# Altium schematic sheet Power.SchDoc
size A3; SheetNumber: 9; SheetTotal: 11
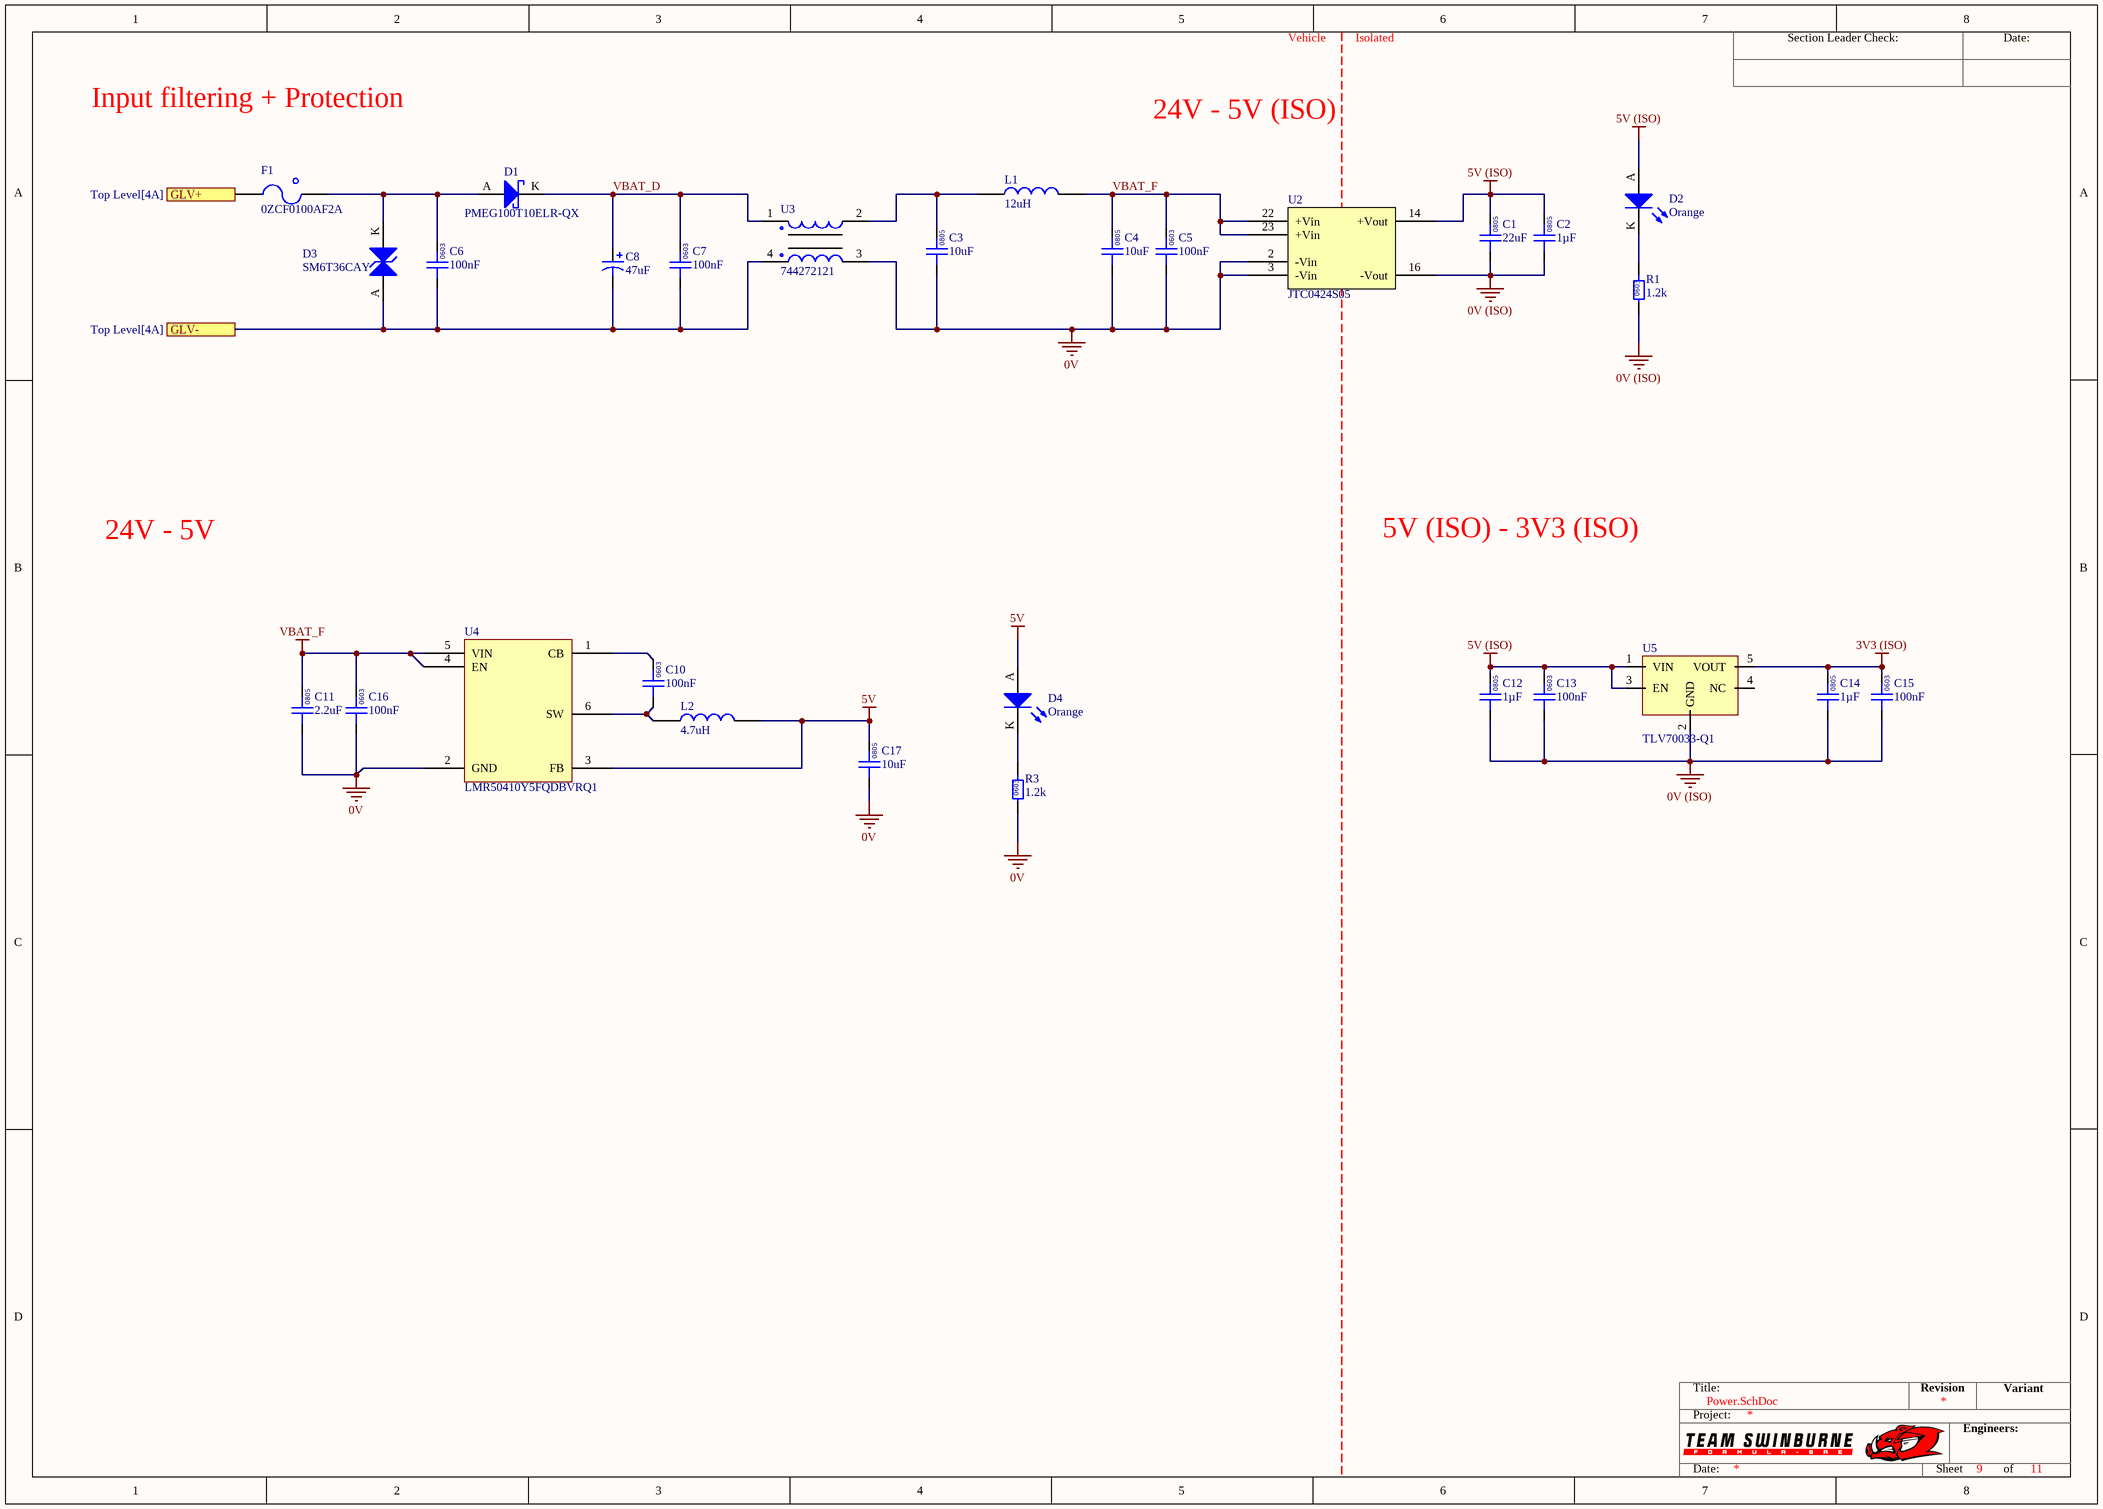
[diagram p0: Power.SchDoc]

## Parts
C1  22uF  [0805]
C2  1µF  [0805]
C3  10uF  [0805]
C4  10uF  [0805]
C5  100nF  [0603]
C6  100nF  [0603]
C7  100nF  [0603]
C8  47uF  [CHEMI-CON ELCO]
C10  100nF  [0603]
C11  2.2uF  [0805]
C12  1µF  [0805]
C13  100nF  [0603]
C14  1µF  [0805]
C15  100nF  [0603]
C16  100nF  [0603]
C17  10uF  [0805]
D1  PMEG100T10ELR-QX  [NXP SOD123W]
D2  Orange  [0805 LED]
D3  SM6T36CAY  [ST SMB DIODE]
D4  Orange  [0805 LED]
F1  0ZCF0100AF2A  [2920]
L1  12uH  [1812]
L2  4.7uH  [SRN3015TA-4R7M]
R1  1.2k  [0603]
R3  1.2k  [0603]
U2  JTC0424S05  [24-DIP Module, 7 Leads]
U3  744272121  [Wurth 4-PC Pad]
U4  LMR50410Y5FQDBVRQ1  [TI-SOT23-6]
U5  TLV70033-Q1  [TI SOT-23-5]

## Ports
GLV+ (see Top Level[4A]), GLV- (see Top Level[4A])

## Nets
0V: C3.1 C4.1 C5.1 C11.1 C16.1 C17.1 R3.1 U2.2(-Vin) U2.3(-Vin) U3.3 U4.2(GND)
0V (ISO): C1.1 C2.1 C12.1 C13.1 C14.1 C15.1 R1.1 U2.16(-Vout) U5.2(GND)
3V3 (ISO): C14.2 C15.2 U5.5(VOUT)
5V: C17.2 D4.A L2.1 U4.3(FB)
5V (ISO): C1.2 C2.2 C12.2 C13.2 D2.A U2.14(+Vout) U5.1(VIN) U5.3(EN)
VBAT_F: C4.2 C5.2 C11.2 C16.2 L1.1 U2.22(+Vin) U2.23(+Vin) U4.4(EN) U4.5(VIN)
GLV+: F1.1 ; port GLV+
GLV-: C6.1 C7.1 C8.1 D3.A U3.4 ; port GLV-
VBAT_D: C7.2 C8.2 D1.K U3.1
NetC3_2: C3.2 L1.2 U3.2
NetC6_2: C6.2 D1.A D3.K F1.2
NetC10_1: C10.1 L2.2 U4.6(SW)
NetC10_2: C10.2 U4.1(CB)
NetD2_K: D2.K R1.2
NetD4_K: D4.K R3.2

Not connected (* = marked no-connect by the designer): U5 4(NC)

## Notes on the sheet
- Vehicle
- Isolated
- Input filtering + Protection
- 24V - 5V (ISO)
- 24V - 5V
- 5V (ISO) - 3V3 (ISO)
- Section Leader Check:
- Date:
- Title:
- Revision
- Variant
- Project:
- Engineers:
- Sheet
- of
- (in symbol GCM21BR71H105KA03L) 0805
- (in symbol GCM188L81H104KA57D) 0603
- (in symbol GRM21BR6YA106KE43L) 0805
- (in symbol GRM21BR61A226ME51L) 0805
- (in symbol GRM21BR71E225KE11L) 0805
- (in symbol RC0603JR-071K2L) 0603

## Library data of the parts
C1 = GRM21BR61A226ME51L: Manufacturer: muRata; Rated Voltage: 10V; Tolerance: 20%; Material: MLCC; Temperature Rating: X5R; Part Number: GRM21BR61A226ME51L; Value: 22uF; Digikey Part Number: 490-10511-1-ND
C2 C12 C14 = GCM21BR71H105KA03L: Manufacturer: muRata; Rated Voltage: 50V; Tolerance: ±10%; Material: MLCC; Temperature Rating: X7R; Part Number: GCM21BR71H105KA03L; Value: 1µF; Digikey Part Number: 490-10675-1-ND
C3 C4 C17 = GRM21BR6YA106KE43L: Manufacturer: muRata; Rated Voltage: 50V; Tolerance: 10%; Material: MLCC; Temperature Rating: X5R; Part Number: GRM21BR6YA106KE43L; Value: 10uF; Digikey Part Number: 490-10514-6-ND
C5-C7 C10 C13 C15 C16 = GCM188L81H104KA57D: Manufacturer: muRata; Rated Voltage: 50V; Tolerance: ±10%; Material: MLCC; Temperature Rating: X8L; Part Number: GCM188L81H104KA57D; Value: 100nF; Digikey Part Number: 490-6049-1-ND
C8 = HHXA350ARA470MF61G: Manufacturer: Chemi-Con; Rated Voltage: 35V; Tolerance: 20%; Material: Aluminium Electrolytic; Temperature Rating: 125C; Part Number: HHXA350ARA470MF61G; Value: 47uF
C11 = GRM21BR71E225KE11L: Manufacturer: Murata Electronics; Rated Voltage: 25V; Tolerance: ±10%; Material: MLCC; Temperature Rating: X7R; Part Number: GRM21BR71E225KE11L; Value: 2.2uF; Digikey Part Number: 490-14467-2-ND
D1 = PMEG100T10ELR-QX: Manufacturer: Nexperia USA Inc.; Forward Voltage: 0.75 V @ 1A; Breakdown Voltage: 100 V; Rated Power: 680 mW; Part Number: PMEG100T10ELR-QX; Digikey Part Number: 1727-PMEG100T10ELR-QXCT-ND
D2 D4 = SML-211DTT86: Orange LED Indication - Discrete 1.75V 0805 (2012 Metric); Manufacturer: ROHM Semiconductor; Part Number: SML-211DTT86; Colour: Orange; Digikey Part Number: 511-1291-1-ND
D3 = SM6T36CAY: Manufacturer: STMicroelectronics; Forward Voltage: 30.8 V; Rated Power: 600W; Part Number: SM6T36CAY; Breakdown Voltage: 30.8 V; Digikey Part Number: 497-10804-1-ND
F1 = 0ZCF0100AF2A: PTC RESET FUSE 60V 1A 292; Manufacturer: Littelfuse Inc.; Part Number: 0ZCF0100AF2A; Digikey Part Number: 507-2070-1-ND; Digikey Link: https://www.digikey.com/product-detail/en/bel-fuse-inc/0ZCF0100AF2A/507-2070-1-ND/6210547
L1 = RLS-126: Manufacturer: Recom; Tolerance: 0.2; Impedance: 230mOhm; Rated Current: 0.8 A; Material: Wirewound; Part Number: RLS-126; Value: 12uH; Digikey Part Number: 945-3429-ND
L2 = SRN4018-4R7M: Manufacturer: Bourns; Tolerance: 0.2; Impedance: 84mOhms; Rated Current: 1.9A; Material: Wirewound; Part Number: SRN4018-4R7M; Value: 4.7uH; Digikey Part Number: SRN3015TA-4R7MCT-ND
R1 R3 = RC0603JR-071K2L: Manufacturer: YAGEO; Tolerance: 0.01; Rated Power: 0.1W; Part Number: RC0603JR-071K2L; Value: 1.2k; Material: FR-07; Digikey Part Number: 311-1.2KGRCT-ND
U2 = JTC0424S05: DC DC CONVERTER 5V 4W; Manufacturer: XP Power; Input Voltage: 9V-36V; Efficiency: 0.79; Isolation: Isolated; Part Number: JTC0424S05; Output Voltage: 5V; Output Power: 4W; Digikey Part Number: JTC0424S05-ND; Digikey Link: https://www.digikey.com/products/en?keywords=%20JTC0424S05
U3 = 744272121: Manufacturer: Wurth Electronics Inc; Value: 120uH @ 100kHz; Impedance: 460 Ohms @ 30MHz; Rated Current: 2.5 A; Part Number: 744272121; Material: Wirewound; Digikey Part Number: 732-1489-1-ND
U4 = LMR50410-Q1: IC REG BUCK 5V 1A SOT23-6; Manufacturer: Texas Instruments; Input Voltage: 4-36V; Part Number: LMR50410-Q1; Output Voltage: 5V; Output Current: 1A; Digikey Part Number: 296-LMR50410Y5FQDBVRQ1CT-ND
U5 = TLV70033-Q1: IC REG LINEAR 3.3V 200MA SOT23-5; Manufacturer: Texas Instruments; Input Voltage: 2 to 5.5 V; Output Current: 0.2 A; Part Number: TLV70033-Q1; Output Voltage: 3.3 V; Digikey Part Number: 296-27780-1-ND